# EAGLE design alarmclock3 (EAGLE 6.6.0)
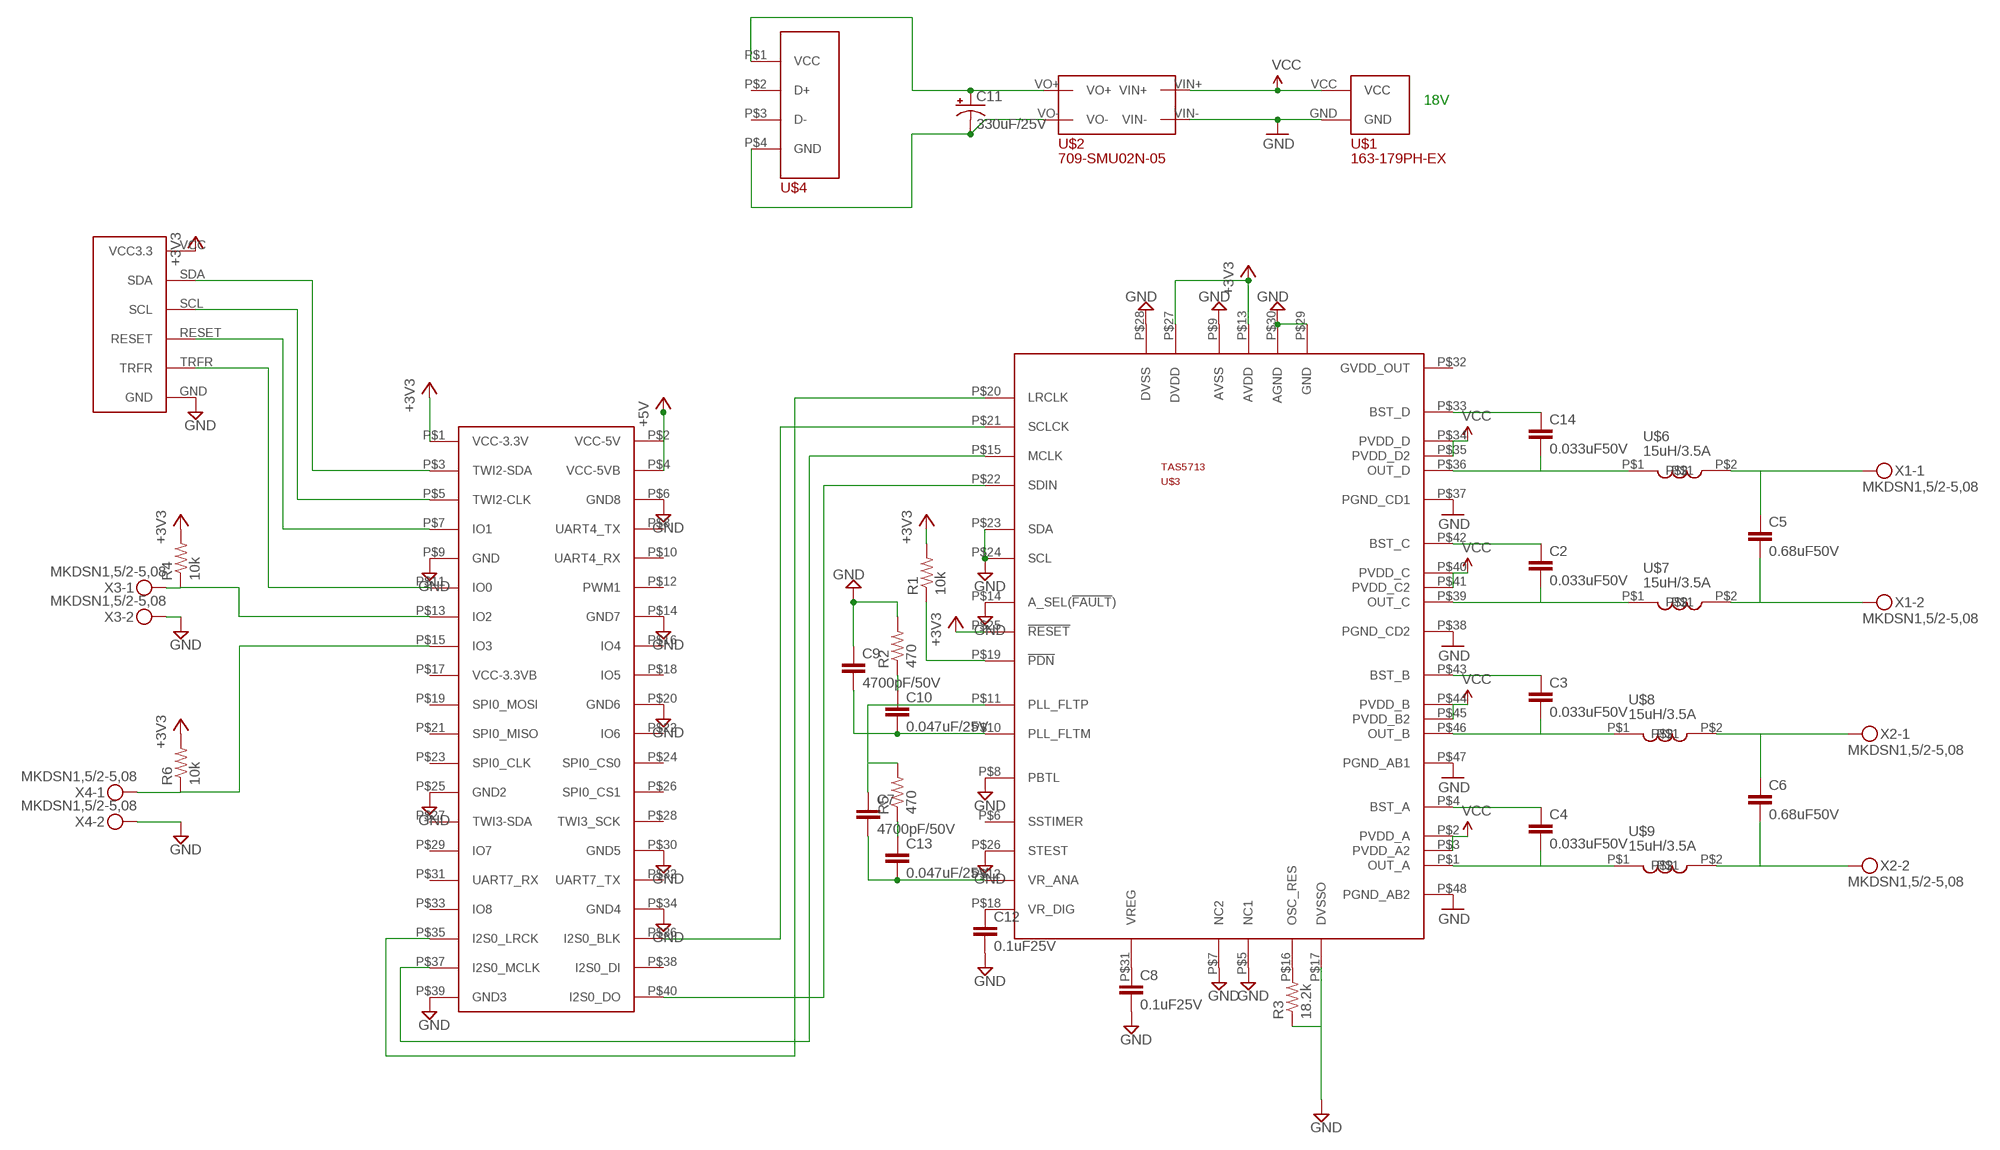
[diagram p0: schematic, sheet 1]

## Parts
C2  0.033uF50V  CAP0603-CAP  [0603-CAP]
C3  0.033uF50V  CAP0603-CAP  [0603-CAP]
C4  0.033uF50V  CAP0603-CAP  [0603-CAP]
C5  0.68uF50V  CAP0603-CAP  [0603-CAP]
C6  0.68uF50V  CAP0603-CAP  [0603-CAP]
C7  4700pF/50V  CAP0603-CAP  [0603-CAP]
C8  0.1uF25V  CAP0603-CAP  [0603-CAP]
C9  4700pF/50V  CAP0603-CAP  [0603-CAP]
C10  0.047uF/25V  CAP0603-CAP  [0603-CAP]
C11  330uF/25V  CAP_POLPTH2  [CPOL-RADIAL-10UF-25V]
C12  0.1uF25V  CAP0603-CAP  [0603-CAP]
C13  0.047uF/25V  CAP0603-CAP  [0603-CAP]
C14  0.033uF50V  CAP0603-CAP  [0603-CAP]
R1  10k  RESISTOR0603-RES  [0603-RES]
R2  470  RESISTOR0603-RES  [0603-RES]
R3  18.2k  RESISTOR0603-RES  [0603-RES]
R4  10k  RESISTOR0603-RES  [0603-RES]
R5  470  RESISTOR0603-RES  [0603-RES]
R6  10k  RESISTOR0603-RES  [0603-RES]
U$1  163-179PH-EX  [163-179PH-EX_DIM]
U$2  709-SMU02N-05  [709-SMU02N-05_DIM]
U$3  TAS5713  [TAS5713_DIM]
U$4  USB_TYPEA_CONNECTOR  [USB_DIM]
U$5  BANANAPRO-CON6  [BANANAPRO-CON6_DIM]
U$6  15uH/3.5A  MSS1260INDUCTOR  [MSS1260_DIM]
U$7  15uH/3.5A  MSS1260INDUCTOR  [MSS1260_DIM]
U$8  15uH/3.5A  MSS1260INDUCTOR  [MSS1260_DIM]
U$9  15uH/3.5A  MSS1260INDUCTOR  [MSS1260_DIM]
U$10  SKYWRITER  [SKYWRITER_DIM]
X1  MKDSN1,5/2-5,08  [MKDSN1,5/2-5,08]
X2  MKDSN1,5/2-5,08  [MKDSN1,5/2-5,08]
X3  MKDSN1,5/2-5,08  [MKDSN1,5/2-5,08]
X4  MKDSN1,5/2-5,08  [MKDSN1,5/2-5,08]

## Nets
+3V3: R1.2 R4.2 R6.2 U$3.P$13(AVDD) U$3.P$25(!RESET!) U$3.P$27(DVDD) U$5.P$1(VCC-3.3V) U$10.VCC(VCC3.3)
+5V: U$5.P$2(VCC-5V) U$5.P$4(VCC-5VB)
GND [amplified]: C8.2 C9.1 C12.2 R2.2 R3.1 U$1.GND U$2.VIN- U$3.P$5(NC1) U$3.P$7(NC2) U$3.P$8(PBTL) U$3.P$9(AVSS) U$3.P$14(A_SEL(!FAULT!)) U$3.P$17(DVSSO) U$3.P$23(SDA) U$3.P$24(SCL) U$3.P$26(STEST) U$3.P$28(DVSS) U$3.P$29(GND) U$3.P$30(AGND) U$3.P$37(PGND_CD1) U$3.P$38(PGND_CD2) U$3.P$47(PGND_AB1) U$3.P$48(PGND_AB2) U$5.P$6(GND8) U$5.P$9(GND) U$5.P$14(GND7) U$5.P$20(GND6) U$5.P$25(GND2) U$5.P$30(GND5) U$5.P$34(GND4) U$5.P$39(GND3) U$10.GND X3.2 X4.2
N$1: U$3.P$22(SDIN) U$5.P$40(I2S0_DO)
N$2: U$3.P$15(MCLK) U$5.P$37(I2S0_MCLK)
N$3: C11.1(+) U$2.VO+ U$4.P$1(VCC)
N$4: U$3.P$20(LRCLK) U$5.P$35(I2S0_LRCK)
N$5: U$3.P$21(SCLCK) U$5.P$36(I2S0_BLK)
N$6: R6.1 U$5.P$15(IO3) X4.1
N$7: R3.2 U$3.P$16(OSC_RES)
N$8: R4.1 U$5.P$13(IO2) X3.1
N$9 [amplified]: C6.1 U$8.P$2 X2.1
N$10 [amplified]: C14.2 U$3.P$36(OUT_D) U$6.P$1
N$11: C14.1 U$3.P$33(BST_D)
N$12: C4.1 U$3.P$4(BST_A)
N$13 [amplified]: C4.2 U$3.P$1(OUT_A) U$9.P$1
N$14 [amplified]: C3.2 U$3.P$46(OUT_B) U$8.P$1
N$15: C3.1 U$3.P$43(BST_B)
N$16 [amplified]: C2.2 U$3.P$39(OUT_C) U$7.P$1
N$17: C2.1 U$3.P$42(BST_C)
N$18 [amplified]: C6.2 U$9.P$2 X2.2
N$19 [amplified]: C5.2 U$7.P$2 X1.2
N$20 [amplified]: C5.1 U$6.P$2 X1.1
N$21: C7.1 R5.2 U$3.P$11(PLL_FLTP)
N$22: C7.2 C13.2 U$3.P$12(VR_ANA)
N$23: C9.2 C10.2 U$3.P$10(PLL_FLTM)
N$24: C13.1 R5.1
N$25: C10.1 R2.1
N$26: C8.1 U$3.P$31(VREG)
N$27: C12.1 U$3.P$18(VR_DIG)
N$28: R1.1 U$3.P$19(!PDN!)
N$29 [amplified]: C11.2(-) U$2.VO- U$4.P$4(GND)
N$30: U$5.P$3(TWI2-SDA) U$10.SDA
N$31: U$5.P$5(TWI2-CLK) U$10.SCL
N$32: U$5.P$7(IO1) U$10.RESET
N$33: U$5.P$11(IO0) U$10.TRFR
VCC [amplified]: U$1.VCC U$2.VIN+ U$3.P$2(PVDD_A) U$3.P$3(PVDD_A2) U$3.P$34(PVDD_D) U$3.P$35(PVDD_D2) U$3.P$40(PVDD_C) U$3.P$41(PVDD_C2) U$3.P$44(PVDD_B) U$3.P$45(PVDD_B2)
Unconnected: U$3.P$6(SSTIMER) U$3.P$32(GVDD_OUT) U$4.P$2(D+) U$4.P$3(D-) U$5.P$8(UART4_TX) U$5.P$10(UART4_RX) U$5.P$12(PWM1) U$5.P$16(IO4) U$5.P$17(VCC-3.3VB) U$5.P$18(IO5) U$5.P$19(SPI0_MOSI) U$5.P$21(SPI0_MISO) U$5.P$22(IO6) U$5.P$23(SPI0_CLK) U$5.P$24(SPI0_CS0) U$5.P$26(SPI0_CS1) U$5.P$27(TWI3-SDA) U$5.P$28(TWI3_SCK) U$5.P$29(IO7) U$5.P$31(UART7_RX) U$5.P$32(UART7_TX) U$5.P$33(IO8) U$5.P$38(I2S0_DI)

## Notes on the sheet
- 18V

## Library data of the parts
C2-C10 C12-C14 = SparkFun-Capacitors:CAP: Capacitor Standard 0603 ceramic capacitor, and 0.1" leaded capacitor.
C11 = SparkFun-Passives:CAP_POL: Capacitor Polarized These are standard SMD and PTH capacitors. Normally 10uF, 47uF, and 100uF in electrolytic and tantalum varieties. Always verify the external diameter of the through hole cap, it varies with capacity, voltage, and manufacturer. The EIA devices should be standard.
R1-R6 = SparkFun-Passives:RESISTOR: Resistor Basic schematic elements and footprints for 0603, 1206, and PTH resistors.
U$1 = mouser:163-179PH-EX: BARREL POWER PLUG
U$2 = mouser:709-SMU02N-05
U$3 = mouser:TAS5713
U$4 = mouser:USB_TYPEA_CONNECTOR: ref Mouser: 710-61400416021
U$5 = mouser:BANANAPRO-CON6: Mouser 571-7-534206-0
U$6-U$9 = mouser:MSS1260
U$10 = skywriter:SKYWRITER
X1-X4 = con-phoenix-508:MKDSN1,5/2-5,08: MKDSN 1,5/ 2-5,08 Printklemme Nennstrom: 13,5 A Nennspannung: 250 V Rastermaß: 5,08 mm Polzahl: 2 Anschlussart: Schraubanschluss Montage: Löten Anschlussrichtung Leiter/Platine: 0 ° Artikelnummer: 1729128 Source: http://eshop.phoenixcontact.com .. 1729128.pdf

## Net classes
1 amplified: width 0.025 mm

## Board
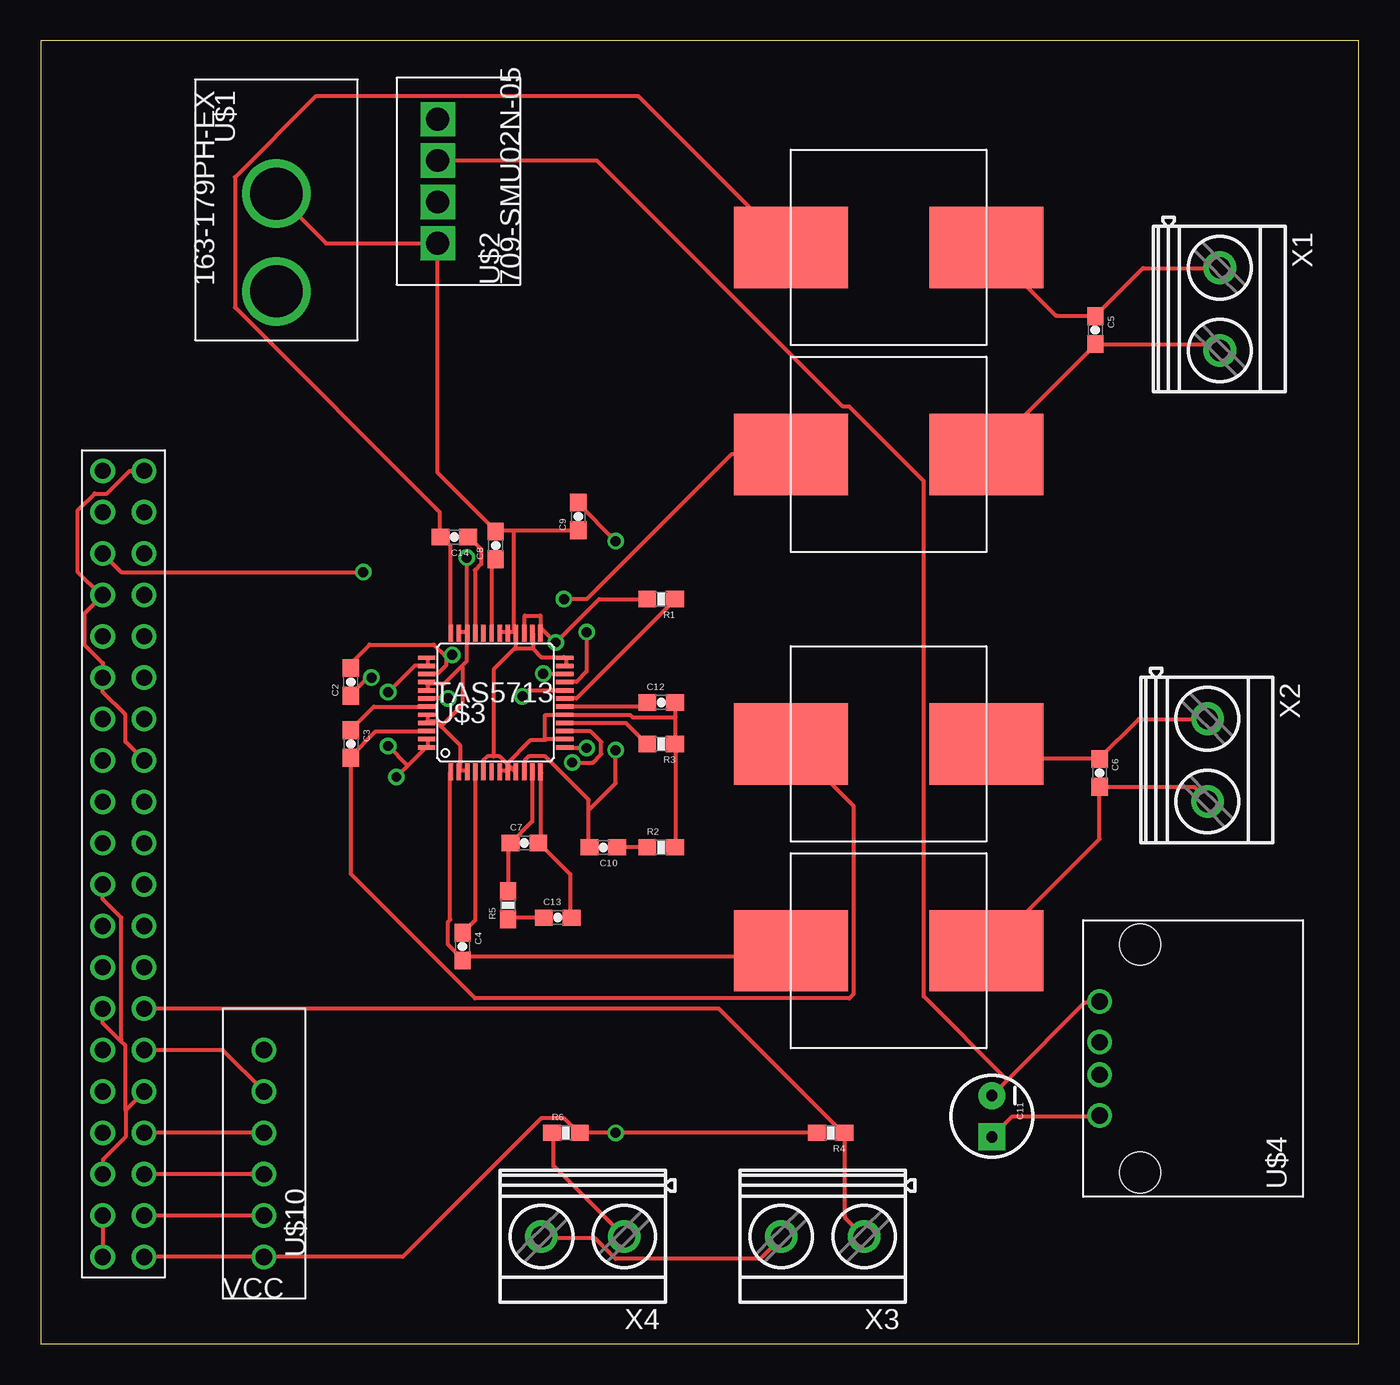
[diagram p1: board, top side]
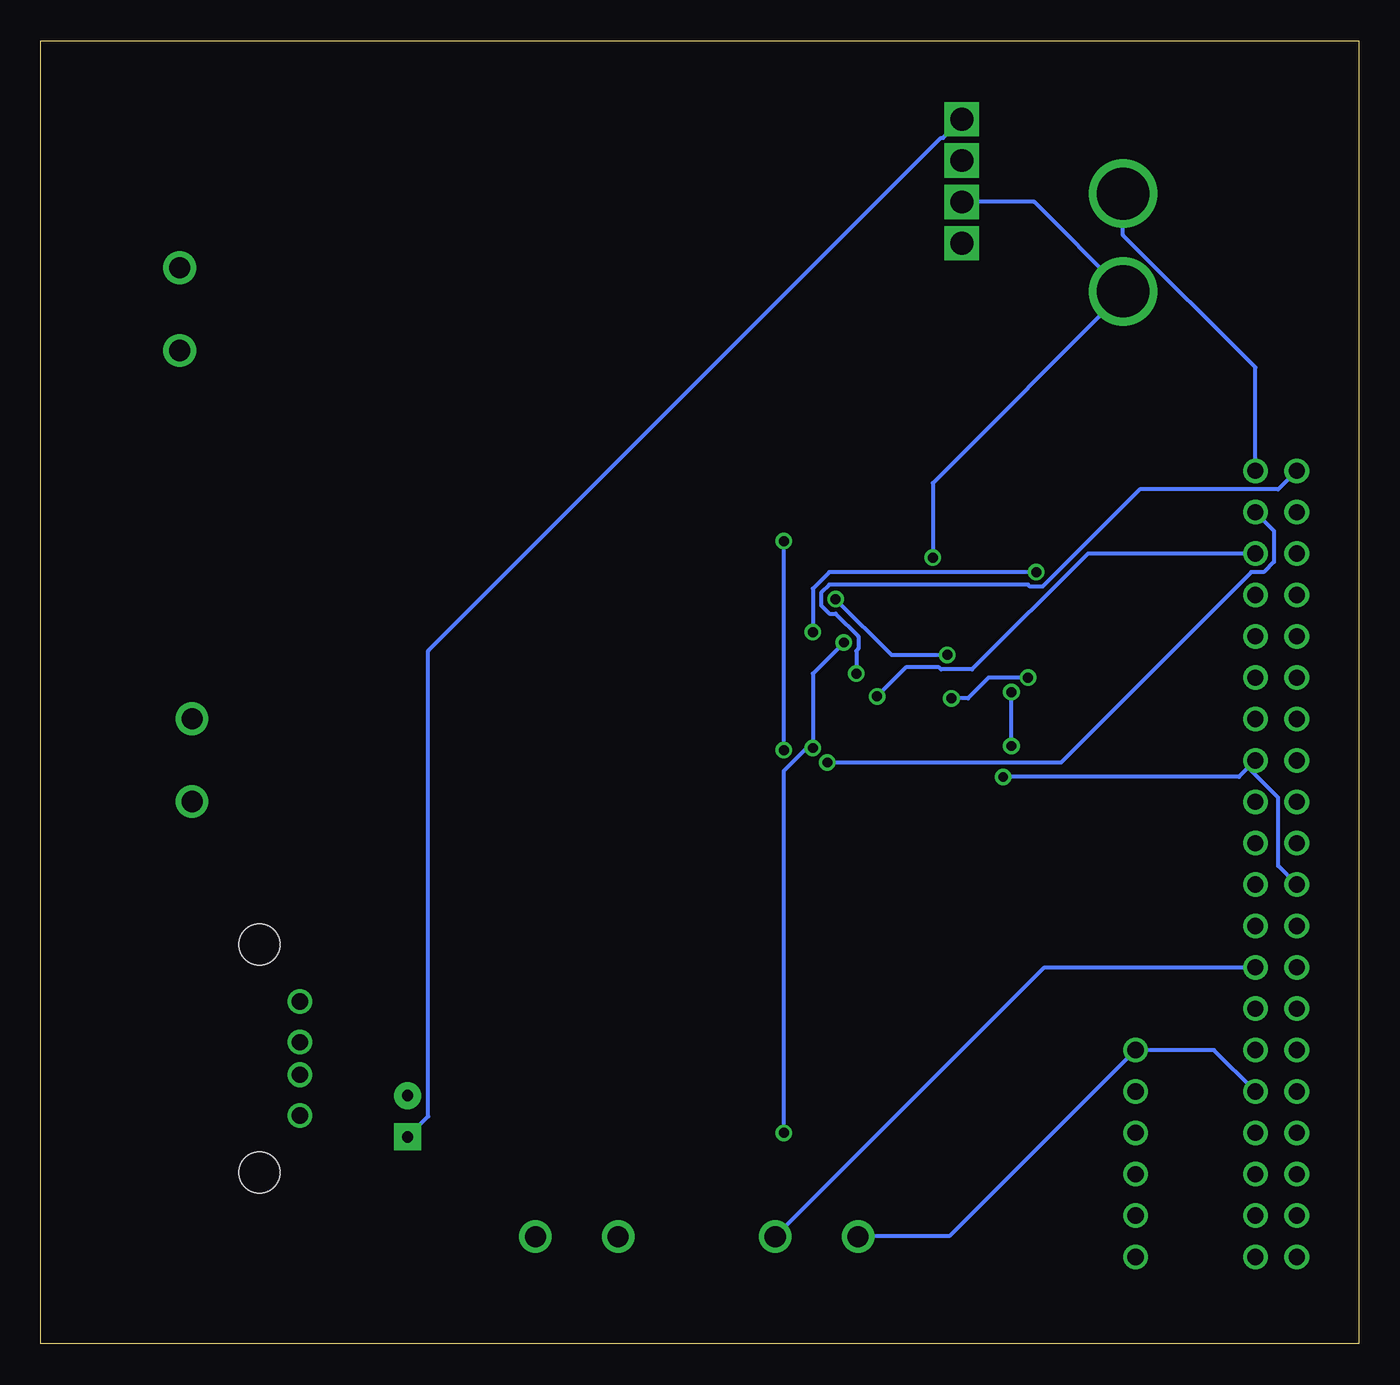
[diagram p2: board, bottom side, seen from below]

Size 80.95 x 80 mm. Coordinates in mm from the lower left corner, seen from the top.
Outline: 0,0 80.95,0 80.95,80 0,80 0,0
Copper layers (1*16): Top 0.035mm / dielectric 1.5mm / Bottom 0.035mm
Design rules "default": minimum track width 10mil, minimum drill 24mil, track to track 8mil, track to pad 8mil, pad to pad 8mil, via to via 8mil, smd to smd 8mil, copper to edge 40mil, drill to drill 8mil, minimum pad ring 10mil, minimum via ring 8mil, stop-mask expansion 4mil, vias tented up to drill 0mil, thermal gap 10mil

### Footprints (pad centres in the part's own frame; a part is rotated, then mirrored left to right if it is on the bottom)
0603-CAP = smd 1.1 x 1: 1 -0.85,0; 2 0.85,0
CPOL-RADIAL-10UF-25V = drill 0.7 pad 1.651 square: 1 1.27,0 | drill 0.7 pad 1.651: 2 -1.27,0
0603-RES = smd 1.1 x 1: 1 -0.85,0; 2 0.85,0
163-179PH-EX_DIM = drill 3.2: GND 0,0; VCC 6,0
709-SMU02N-05_DIM = drill 1.4 square: VIN+ -2.54,0; VIN- -5.08,0; VO+ 2.54,0; VO- 0,0
TAS5713_DIM = smd 0.27 x 1.05: P$1 -2.75,-4.25; P$2 -2.25,-4.25; P$3 -1.75,-4.25; P$4 -1.25,-4.25; P$5 -0.75,-4.25; P$6 -0.25,-4.25; P$7 0.25,-4.25; P$8 0.75,-4.25; P$9 1.25,-4.25; P$10 1.75,-4.25; P$11 2.25,-4.25; P$12 2.75,-4.25; P$25 2.75,4.25; P$26 2.25,4.25; P$27 1.75,4.25; P$28 1.25,4.25; P$29 0.75,4.25; P$30 0.25,4.25; P$31 -0.25,4.25; P$32 -0.75,4.25; P$33 -1.25,4.25; P$34 -1.75,4.25; P$35 -2.25,4.25; P$36 -2.75,4.25 | smd 1.05 x 0.27: P$13 4.25,-2.75; P$14 4.25,-2.25; P$15 4.25,-1.75; P$16 4.25,-1.25; P$17 4.25,-0.75; P$18 4.25,-0.25; P$19 4.25,0.25; P$20 4.25,0.75; P$21 4.25,1.25; P$22 4.25,1.75; P$23 4.25,2.25; P$24 4.25,2.75; P$37 -4.25,2.75; P$38 -4.25,2.25; P$39 -4.25,1.75; P$40 -4.25,1.25; P$41 -4.25,0.75; P$42 -4.25,0.25; P$43 -4.25,-0.25; P$44 -4.25,-0.75; P$45 -4.25,-1.25; P$46 -4.25,-1.75; P$47 -4.25,-2.25; P$48 -4.25,-2.75
USB_DIM = drill 1: P$1 -3,0; P$2 -0.5,0; P$3 1.5,0; P$4 4,0 | hole 2.5: -6.5,-2.5; 7.5,-2.5
BANANAPRO-CON6_DIM = drill 1: P$1 -1.27,10.16; P$2 1.27,10.16; P$3 -1.27,7.62; P$4 1.27,7.62; P$5 -1.27,5.08; P$6 1.27,5.08; P$7 -1.27,2.54; P$8 1.27,2.54; P$9 -1.27,0; P$10 1.27,0; P$11 -1.27,-2.54; P$12 1.27,-2.54; P$13 -1.27,-5.08; P$14 1.27,-5.08; P$15 -1.27,-7.62; P$16 1.27,-7.62; P$17 -1.27,-10.16; P$18 1.27,-10.16; P$19 -1.27,-12.7; P$20 1.27,-12.7; P$21 -1.27,-15.24; P$22 1.27,-15.24; P$23 -1.27,-17.78; P$24 1.27,-17.78; P$25 -1.27,-20.32; P$26 1.27,-20.32; P$27 -1.27,-22.86; P$28 1.27,-22.86; P$29 -1.27,-25.4; P$30 1.27,-25.4; P$31 -1.27,-27.94; P$32 1.27,-27.94; P$33 -1.27,-30.48; P$34 1.27,-30.48; P$35 -1.27,-33.02; P$36 1.27,-33.02; P$37 -1.27,-35.56; P$38 1.27,-35.56; P$39 -1.27,-38.1; P$40 1.27,-38.1
MSS1260_DIM = smd 5 x 7: P$1 0,6; P$2 0,-6
SKYWRITER_DIM = drill 1: GND 0,7.62; RESET 0,2.54; SCL 0,0; SDA 0,-2.54; TRFR 0,5.08; VCC 0,-5.08
MKDSN1,5/2-5,08 = drill 1.3 pad 2: 1 -2.561,0.025; 2 2.519,0.025

### Placement (x,y rotation side)
C2  19.05,40.64 90 top
C3  19.05,36.83 270 top
C4  25.91,24.38 270 top
C5  64.77,62.23 270 top
C6  65.02,35.05 270 top
C7  29.71,30.74 0 top
C8  27.94,49.02 90 top
C9  33.02,50.8 90 top
C10  34.54,30.48 180 top
C11  58.42,13.97 270 top
C12  38.1,39.37 0 top
C13  31.75,26.16 0 top
C14  25.4,49.53 180 top
R1  38.1,45.72 180 top
R2  38.1,30.48 0 top
R3  38.1,36.83 180 top
R4  48.51,12.95 180 top
R5  28.7,26.92 90 top
R6  32.26,12.95 0 top
U$1  14.48,70.61 270 top
U$2  24.38,72.64 90 top
U$3  27.94,39.37 0 top
U$4  65.02,17.02 90 top
U$5  5.08,15.49 180 top
U$6  52.07,67.31 90 top
U$7  52.07,54.61 90 top
U$8  52.07,36.83 90 top
U$9  52.07,24.13 90 top
U$10  13.72,10.41 0 top
X1  72.39,63.5 270 top
X2  71.63,35.81 270 top
X3  48.01,6.6 180 top
X4  33.27,6.6 180 top

### Tracks (layer width: path | path; a pad name or v marks a point on that pad's centre or on a via)
+3V3  (via drill 0.61)
  Top 0.254: U$3.P$27 29.72,43.62 29.72,44.7 30.69,44.7 U$3.P$25 30.73,43.94 v31.62,43.05 34.29,45.72 R1.2 | v33.53,36.58 32.26,36.58 U$3.P$13 | U$5.P$1 U$10.VCC 22.23,5.33 30.73,13.84 32.13,13.84 33.02,12.95 R6.2 v35.31,12.95 R4.2
  Bottom 0.254: v31.62,43.05 33.53,41.15 v33.53,36.58 33.91,36.58 35.31,35.18 v35.31,12.95
+5V
  Top 0.254: U$5.P$4 U$5.P$2
GND  (via drill 0.61)
  Top 0.254: U$3.P$14 30.99,37.12 | 30.99,37.12 30.99,38.61 32.19,38.61 U$3.P$17 32.26,38.61 36.2,38.61 36.32,38.48 38.99,38.48 | U$3.P$26 30.23,43.62 30.23,42.67 | 30.23,42.67 29.19,42.67 | 29.19,42.67 U$3.P$28 | U$1.GND 17.53,67.56 U$2.VIN- 24.38,53.47 27.94,49.91 | 38.99,36.83 38.99,30.48 R2.2 | 38.99,36.83 38.99,38.48 | 38.99,38.48 38.99,39.37 C12.2 | 38.99,36.83 R3.1 | 29.08,49.91 33.02,49.91 C9.1 | 29.08,49.91 27.94,49.91 | U$3.P$7 28.19,35.18 28.57,35.18 U$3.P$8 28.7,35.18 28.89,35.37 | 27.81,36.07 28.19,36.07 28.64,35.62 | 27.81,36.07 27.43,36.07 27.18,35.81 27.18,35.18 U$3.P$5 | 28.89,35.37 29.08,35.18 U$3.P$9 | 28.89,35.37 28.64,35.62 | 28.64,35.62 30.1,37.08 30.99,37.08 30.99,37.12 | U$3.P$30 28.19,43.69 28.57,43.69 U$3.P$29 28.7,43.69 29.08,43.69 U$3.P$28 | U$3.P$23 32.26,41.66 32.26,42.04 U$3.P$24 32.13,42.16 30.73,42.16 30.23,42.67 | 27.81,36.07 27.81,41.4 29.08,42.67 29.19,42.67 | 29.08,49.91 29.08,43.81 U$3.P$28 | 27.94,49.91 C8.2 | U$5.P$39 5.46,53.59 4.06,52.2 3.3,52.2 2.29,51.18 2.29,47.37 3.68,45.97 U$5.P$34 2.67,44.83 2.67,42.93 3.81,41.78 U$5.P$30 3.81,40.01 5.21,38.61 5.21,36.96 U$5.P$25 | U$3.P$37 23.75,42.04 23.75,41.66 U$3.P$38 23.62,41.66 22.99,41.66 v21.34,40.01 | U$3.P$47 23.75,37.08 23.75,36.7 U$3.P$48 23.62,36.58 22.54,35.5 | v21.84,34.8 22.54,35.5 | 22.54,35.5 v21.34,36.7 | X4.2 30.86,6.48 34.04,6.48 35.31,5.21 44.2,5.21 45.47,6.48 X3.2 | U$5.P$6 3.81,11.3 5.21,12.7 5.21,14.35 5.27,14.41 | U$5.P$9 5.27,14.41 | U$5.P$14 3.81,19.68 4.89,18.61 | 4.89,18.61 5.21,18.29 5.21,14.48 5.27,14.41 | U$5.P$20 3.81,27.3 4.95,26.16 4.95,18.67 4.89,18.61
  Bottom 0.254: v21.84,34.8 7.37,34.8 U$5.P$25 6.73,35.31 4.95,33.53 4.95,29.34 U$5.P$20 | v21.34,36.7 v21.34,40.01 | U$5.P$9 8.89,18.03 U$10.GND 25.15,6.6 30.73,6.6 X4.2 | U$1.GND 14.48,68.07 6.35,59.94 U$5.P$39
N$1  (via drill 0.61)
  Top 0.254: v30.86,41.15 32.13,41.15 U$3.P$22
  Bottom 0.254: v30.86,41.15 30.86,42.55 30.73,42.67 30.73,43.43 32.13,44.83 32.51,44.83 33.02,45.34 33.02,46.1 32.51,46.61 20.32,46.61 20.19,46.48 19.43,46.48 13.46,52.45 4.95,52.45 U$5.P$40
N$2  (via drill 0.61)
  Top 0.254: v32.64,35.69 33.91,35.69 34.42,36.2 34.42,36.96 33.78,37.59 32.26,37.59 U$3.P$15
  Bottom 0.254: v32.64,35.69 18.29,35.69 6.6,47.37 5.84,47.37 5.21,48.01 5.21,49.91 U$5.P$37
N$3
  Top 0.254: C11.1 59.69,13.97 65.02,13.97 U$4.P$1
  Bottom 0.254: U$2.VO+ 25.53,74.04 25.65,74.04 57.15,42.55 57.15,13.97 C11.1
N$4  (via drill 0.61)
  Top 0.254: v29.59,39.75 29.97,40.13 32.13,40.13 U$3.P$20
  Bottom 0.254: v29.59,39.75 27.81,41.53 25.78,41.53 25.65,41.4 23.75,41.4 16.64,48.51 U$5.P$35
N$5  (via drill 0.61)
  Top 0.254: v33.53,43.69 33.53,41.27 32.89,40.64 32.26,40.64 U$3.P$21 | v19.81,47.37 4.95,47.37 U$5.P$36
  Bottom 0.254: v33.53,43.69 33.53,46.35 32.51,47.37 v19.81,47.37
N$6
  Top 0.254: R6.1 31.5,12.95 31.5,10.92 35.81,6.6 X4.1
  Bottom 0.254: U$5.P$15 19.3,23.11 35.81,6.6 X4.1
N$7
  Top 0.254: U$3.P$16 32.26,38.1 35.94,38.1 37.21,36.83 R3.2
N$8
  Top 0.254: X3.1 50.55,6.6 49.4,7.75 49.4,12.95 R4.1 49.28,12.95 41.66,20.57 U$5.P$13
N$9
  Top 0.254: 65.02,35.94 59.05,35.94 58.17,36.83 U$8.P$2 | 65.02,35.94 67.44,38.35 71.63,38.35 X2.1 | 65.02,35.94 C6.1
N$10
  Top 0.254: U$3.P$36 25.15,43.69 25.15,49.02 24.64,49.53 C14.2 24.51,49.53 24.51,51.05 11.94,63.63 11.94,71.63 16.89,76.58 36.7,76.58 45.97,67.31 U$6.P$1
N$11
  Top 0.254: U$3.P$33 26.67,43.69 26.67,47.5 27.05,47.88 27.05,48.77 26.29,49.53 C14.1
N$12
  Top 0.254: U$3.P$4 26.69,26.02 C4.1
N$13
  Top 0.254: U$3.P$1 25.15,35.05 25.15,26.04 25.02,25.91 25.02,24.51 25.91,23.62 C4.2 25.91,23.75 45.59,23.75 45.97,24.13 U$9.P$1
N$14
  Top 0.254: U$3.P$46 23.62,37.59 20.57,37.59 19.05,36.07 C3.2 19.05,28.83 26.67,21.21 49.66,21.21 49.91,21.46 49.91,33.02 46.1,36.83 U$8.P$1
N$15
  Top 0.254: U$3.P$43 23.62,39.12 20.45,39.12 19.05,37.72 C3.1
N$16  (via drill 0.61)
  Top 0.254: 24.83,42.23 24.13,42.93 20.19,42.93 19.05,41.78 C2.2 | 24.83,42.23 24.89,42.16 24.89,41.66 24.38,41.15 23.75,41.15 U$3.P$39 | v25.27,42.29 24.89,42.29 24.83,42.23 | v32.13,45.72 33.53,45.72 42.42,54.61 U$7.P$1
  Bottom 0.254: v25.27,42.29 28.7,42.29 v32.13,45.72
N$17  (via drill 0.61)
  Top 0.254: v25.02,39.62 23.75,39.62 U$3.P$42 | v20.32,40.89 20.07,40.89 19.05,39.88 C2.1
  Bottom 0.254: v25.02,39.62 24,39.62 22.73,40.89 v20.32,40.89
N$18
  Top 0.254: 65.02,34.16 70.87,34.16 71.63,33.4 X2.2 | 65.02,34.16 65.02,30.99 58.17,24.13 U$9.P$2 | 65.02,34.16 C6.2
N$19
  Top 0.254: 64.77,61.34 72.14,61.34 72.39,61.09 X1.2 | 64.77,61.34 58.04,54.61 U$7.P$2 | 64.77,61.34 C5.2
N$20
  Top 0.254: 64.77,63.12 62.36,63.12 58.17,67.31 U$6.P$2 | 64.77,63.12 67.69,66.04 72.39,66.04 X1.1 | 64.77,63.12 C5.1
N$21
  Top 0.254: U$3.P$11 30.19,32.07 C7.1 28.83,30.73 28.7,30.61 R5.2
N$22
  Top 0.254: U$3.P$12 30.73,35.05 30.73,30.99 30.61,30.86 C7.2 30.61,30.73 32.51,28.83 32.51,26.16 C13.2
N$23  (via drill 0.61)
  Top 0.254: 33.66,32.77 33.66,30.48 C10.2 | 33.66,32.77 33.66,33.4 30.99,36.07 29.97,36.07 29.72,35.81 29.72,35.18 U$3.P$10 | v35.31,49.28 33.02,51.56 C9.2 | v35.31,36.45 35.31,34.42 33.66,32.77
  Bottom 0.254: v35.31,36.45 v35.31,49.28
N$24
  Top 0.254: C13.1 28.7,26.16 R5.1
N$25
  Top 0.254: R2.1 C10.1
N$26
  Top 0.254: U$3.P$31 27.69,43.69 27.69,47.88 27.94,48.13 C8.1
N$27
  Top 0.254: U$3.P$18 32.26,39.12 36.96,39.12 37.21,39.37 C12.1
N$28
  Top 0.254: U$3.P$19 32.26,39.62 32.89,39.62 38.99,45.72 R1.1
N$29
  Top 0.254: C11.2 59.37,16.19 | 59.37,16.19 64.14,20.95 65.02,20.95 U$4.P$4 | U$2.VO- 34.16,72.64 49.28,57.53 49.66,57.53 54.23,52.96 54.23,21.34 59.37,16.19
N$30
  Top 0.254: U$10.SDA U$5.P$3
N$31
  Top 0.254: U$10.SCL U$5.P$5
N$32
  Top 0.254: U$10.RESET U$5.P$7
N$33
  Top 0.254: U$5.P$11 11.18,18.03 U$10.TRFR
VCC  (via drill 0.61)
  Top 0.254: U$3.P$44 23.75,38.61 23.75,38.23 U$3.P$45 23.88,38.23 24.26,38.23 24.57,37.91 | U$3.P$3 26.16,35.18 25.78,35.18 U$3.P$2 25.78,35.31 25.78,36.7 24.57,37.91 | U$3.P$41 23.75,40.13 23.75,40.51 U$3.P$40 23.88,40.51 24.77,40.51 25.84,41.59 | U$3.P$35 25.78,43.69 26.16,43.69 U$3.P$34 | 25.84,41.59 26.16,41.91 26.16,43.56 U$3.P$34 | 24.57,37.91 25.91,39.24 25.91,41.53 25.84,41.59 | v26.16,48.26 26.16,43.81 U$3.P$34
  Bottom 0.254: U$2.VIN+ 19.94,70.1 14.48,64.64 U$1.VCC 14.48,64.52 26.16,52.83 v26.16,48.26